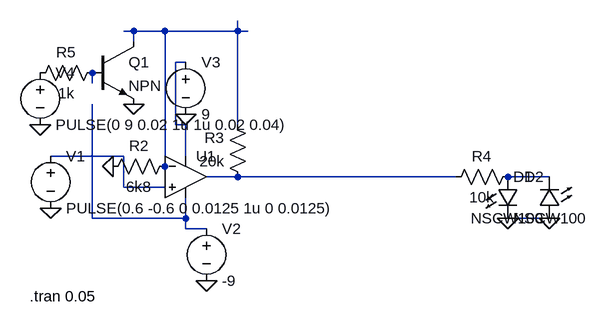
[diagram p0: schematic polyDexVcoToSvfBuffer.asc]
polyDexVcoToSvfBuffer.asc, the LTspice schematic file:
Version 4
SHEET 1 896 680
WIRE 192 -48 176 -48
WIRE 240 -48 192 -48
WIRE 352 -48 352 -64
WIRE 352 -48 240 -48
WIRE 368 -48 352 -48
WIRE 192 -32 192 -48
WIRE 272 0 256 0
WIRE 128 32 128 16
WIRE 256 96 256 0
WIRE 272 96 256 96
WIRE 352 96 352 -48
WIRE 176 144 64 144
WIRE 272 144 272 96
WIRE 240 160 240 -48
WIRE 352 176 304 176
WIRE 688 176 352 176
WIRE 832 176 768 176
WIRE 176 192 176 144
WIRE 240 192 176 192
WIRE 128 240 128 64
WIRE 272 240 272 208
WIRE 272 240 128 240
WIRE 832 240 768 240
WIRE 272 256 272 240
WIRE 304 256 272 256
FLAG 64 224 0
FLAG 304 336 0
FLAG 272 80 0
FLAG 160 160 0
FLAG 48 96 0
FLAG 768 240 0
FLAG 832 240 0
FLAG 192 64 0
SYMBOL voltage 64 128 R0
WINDOW 123 0 0 Left 0
WINDOW 39 0 0 Left 0
SYMATTR InstName V1
SYMATTR Value PULSE(0.6 -0.6 0 0.0125 1u 0 0.0125)
SYMBOL voltage 304 240 R0
WINDOW 123 0 0 Left 0
WINDOW 39 0 0 Left 0
SYMATTR InstName V2
SYMATTR Value -9
SYMBOL voltage 272 -16 R0
WINDOW 123 0 0 Left 0
WINDOW 39 0 0 Left 0
SYMATTR InstName V3
SYMATTR Value 9
SYMBOL Opamps\\UniversalOpamp2 272 176 R0
SYMATTR InstName U1
SYMBOL res 256 144 R90
WINDOW 0 0 56 VBottom 2
WINDOW 3 32 56 VTop 2
SYMATTR InstName R2
SYMATTR Value 6k8
SYMBOL LED 752 176 R0
SYMATTR InstName D1
SYMATTR Value NSCW100
SYMATTR Description Diode
SYMATTR Type diode
SYMBOL LED 848 240 R180
WINDOW 0 24 64 Left 2
WINDOW 3 24 0 Left 2
SYMATTR InstName D2
SYMATTR Value NSCW100
SYMATTR Description Diode
SYMATTR Type diode
SYMBOL res 368 192 R180
WINDOW 0 36 76 Left 2
WINDOW 3 36 40 Left 2
SYMATTR InstName R3
SYMATTR Value 20k
SYMBOL voltage 48 0 R0
WINDOW 123 0 0 Left 0
WINDOW 39 0 0 Left 0
SYMATTR InstName V4
SYMATTR Value PULSE(0 9 0.02 1u 1u 0.02 0.04)
SYMBOL npn 128 -32 R0
SYMATTR InstName Q1
SYMBOL res 784 160 R90
WINDOW 0 0 56 VBottom 2
WINDOW 3 32 56 VTop 2
SYMATTR InstName R4
SYMATTR Value 10k
SYMBOL res 144 0 R90
WINDOW 0 0 56 VBottom 2
WINDOW 3 32 56 VTop 2
SYMATTR InstName R5
SYMATTR Value 1k
TEXT 32 360 Left 2 !.tran 0.05

The netlist it stands for:
* polyDexVcoToSvfBuffer.asc
V1 N004 0 PULSE(0.6 -0.6 0 0.0125 1u 0 0.0125)
V2 N007 0 -9
V3 N002 0 9
XU1 N004 N001 N002 N007 N005 level.2 Avol=1Meg GBW=10Meg Slew=10Meg ilimit=25m rail=0 Vos=0 phimargin=45 en=0 enk=0 in=0 ink=0 Rin=500Meg  ; pins IN+ IN- V+ V- OUT
R2 N001 0 6k8
D1 N006 0 NSCW100
D2 0 N006 NSCW100
R3 N005 N001 20k
V4 P001 0 PULSE(0 9 0.02 1u 1u 0.02 0.04)
Q1 N001 N003 0 0 NPN
R4 N006 N005 10k
R5 N003 P001 1k
.model D D
.lib standard.dio
.model NPN NPN
.model PNP PNP
.lib standard.bjt
.tran 0.05
.lib UniversalOpamps2.sub
.backanno
.end